# Altium schematic sheet display.SchDoc
size A4
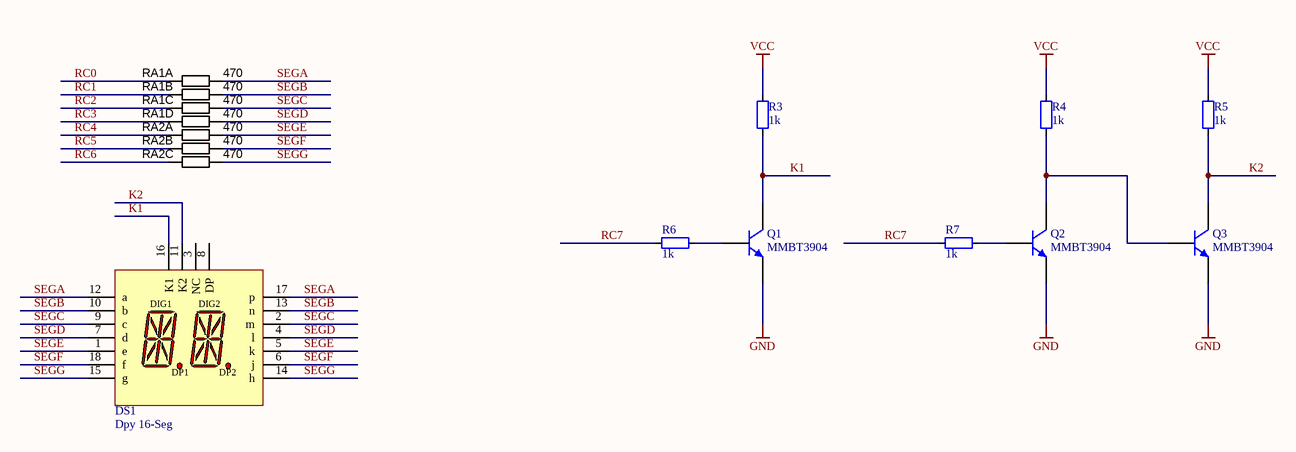
[diagram p0: display.SchDoc]

## Parts
DS1  Dpy 16-Seg  [HDSP-A2]
Q1  MMBT3904  [SOT23_N]
Q2  MMBT3904  [SOT23_N]
Q3  MMBT3904  [SOT23_N]
R3  value 1k  [RES_0603]  (hidden comment: Res_0603)
R4  value 1k  [RES_0603]  (hidden comment: Res_0603)
R5  value 1k  [RES_0603]  (hidden comment: Res_0603)
R6  value 1k  [RES_0603]  (hidden comment: Res_0603)
R7  value 1k  [RES_0603]  (hidden comment: Res_0603)
RA1  value 470  [RESCAXS50P160X320X70-8N]  (hidden comment: Film Res Pack)  (parts A,B,C,D of 4)
RA2  value 470  [RESCAXS50P160X320X70-8N]  (hidden comment: Film Res Pack)  (parts A,B,C of 4)

## Nets
GND: Q1.2(E) Q2.2(E) Q3.2(E)
VCC: R3.2 R4.2 R5.2
K1: DS1.16(K1) Q1.3(C) R3.1
K2: DS1.11(K2) Q3.3(C) R5.1
RC0: RA1.1
RC1: RA1.2
RC2: RA1.3
RC3: RA1.4
RC4: RA2.1
RC5: RA2.2
RC6: RA2.3
RC7: R6.2 R7.2
SEGA: DS1.12(a) DS1.17(p) RA1.8
SEGB: DS1.10(b) DS1.13(n) RA1.7
SEGC: DS1.2(m) DS1.9(c) RA1.6
SEGD: DS1.4(l) DS1.7(d) RA1.5
SEGE: DS1.1(e) DS1.5(k) RA2.8
SEGF: DS1.6(j) DS1.18(f) RA2.7
SEGG: DS1.14(h) DS1.15(g) RA2.6
NetQ1_1: Q1.1(B) R6.1
NetQ2_1: Q2.1(B) R7.1
NetQ2_3: Q2.3(C) Q3.1(B) R4.1

Not connected (* = marked no-connect by the designer): DS1 3(NC) 8(DP)

## Notes on the sheet
- (in symbol Dpy 16-Seg) DIG1; DIG2; DP1; DP2

## Library data of the parts
DS1 = Dpy 16-Seg: 13.7 mm Gray Surface As AlInGaP Red Alphanumeric Display: 2-Character, CC; Published: 8-Jun-2000; LatestRevisionDate: 17-Dec-2003; LatestRevisionNote: Schematic revised, PCB Footprint replaced.; DatasheetVersion: 20-Nov-2001; PackageVersion: 20-Nov-2001; PackageReference: HDSP-A2; Publisher: Altium Limited; PackageDescription: LED, Alphanumeric Display, 13.8 mm, Dual Character; 18 Leads; Row Space 15.24 mm; Pitch 2.54 mm; Colour: As AlInGaP Red; ComponentLink1Description: Manufacturer Link; ComponentLink1URL: http://www.agilent.com/
Q1-Q3 = MMBT3904: NPN Switching Transistor; Published: 17-Sep-2003; LatestRevisionDate: 12-Dec-2006; LatestRevisionNote: IPC-7351 Footprint Added.; DatasheetVersion: 13-May-2002; PackageVersion: May-1999; PackageReference: SOT23; Publisher: Altium Limited; PackageDescription: 3-Pin SOT-23 Package 0.95 mm Pitch, 2.3 mm Lead Span; ComponentLink1Description: Manufacturer Link; ComponentLink1URL: http://www.semiconductors.philips.com/; ComponentLink2Description: Datasheet; ComponentLink2URL: http://www.semiconductors.philips.com/acrobat/datasheets/MMBT3904_4.pdf; Supplier Part Number 1: MMBT3904FSCT-ND; Supplier 1: Digi-Key
R3-R7 = Res_0603: Resistor
RA1 RA2 = RESPACK_1K_5%_4X: Resistor array 1K Ohm 4-pack 62.5mW 5% 4x1608 SMD; Manufacturer 1: Yageo; Manufacturer Part Number 1: YC164-JR-071KL; Ratings: 1/16 W; Number of Resistors: 4; Circuit Type: Isolated; SCDType: source; Package / Case: 1206 (3216 Metric), Convex; Tolerance: ±5%; Number of Pins: 8; Power Per Element: 62.5mW; Mounting Type: Surface Mount; Supplier Device Package: 4 x 0603; Operating Temperature: -55°C ~ 155°C; ComponentLink1URL: http://www.yageo.com/documents/recent/PYu-YC_TC164_51_RoHS_L_3.pdf; ComponentLink1Description: http://www.yageo.com/documents/recent/PYu-YC_TC164_51_RoHS_L_3.pdf; Supplier 1: Digi-Key; Supplier Part Number 1: YC164J-1.0KCT-ND; Supplier 2: Digi-Key; Supplier Part Number 2: CRA6S81.0KCT-ND; Manufacturer 2: Vishay Dale; Manufacturer Part Number 2: CRA06S0831K00JTA; ComponentLink2URL: http://www.vishay.com/doc?31002; ComponentLink2Description: http://www.vishay.com/doc?31002; Supplier 3: Digi-Key; Supplier Part Number 3: RAVF164DJT1K00CT-ND; Manufacturer 3: Stackpole Electronics Inc; Manufacturer Part Number 3: RAVF164DJT1K00; RoHS 3: RoHS Compliant; Size / Dimension: 0.126" L x 0.063" W (3.20mm x 1.60mm); ComponentLink3URL: http://www.seielect.com/Catalog/SEI-RAVF.pdf; ComponentLink3Description: http://www.seielect.com/Catalog/SEI-RAVF.pdf; Supplier 4: Digi-Key; Supplier Part Number 4: Y9102CT-ND; Manufacturer 4: Panasonic Electronic Components; Manufacturer Part Number 4: EXB-38V102JV; RoHS 4: RoHS Compliant; ComponentLink4URL: http://industrial.panasonic.com/www-cgi/jvcr13pz.cgi?E+PZ+3+AOC0001+EXB38V102JV+7+WW; ComponentLink4Description: http://industrial.panasonic.com/www-cgi/jvcr13pz.cgi?E+PZ+3+AOC0001+EXB38V102JV+7+WW; Manufacturer Part Number 5: 4D03WGJ0102T5E; Manufacturer 5: Royal Ohm